# Altium schematic sheet WIRELESS.SchDoc
size A4; SheetNumber: 7; SheetTotal: 7
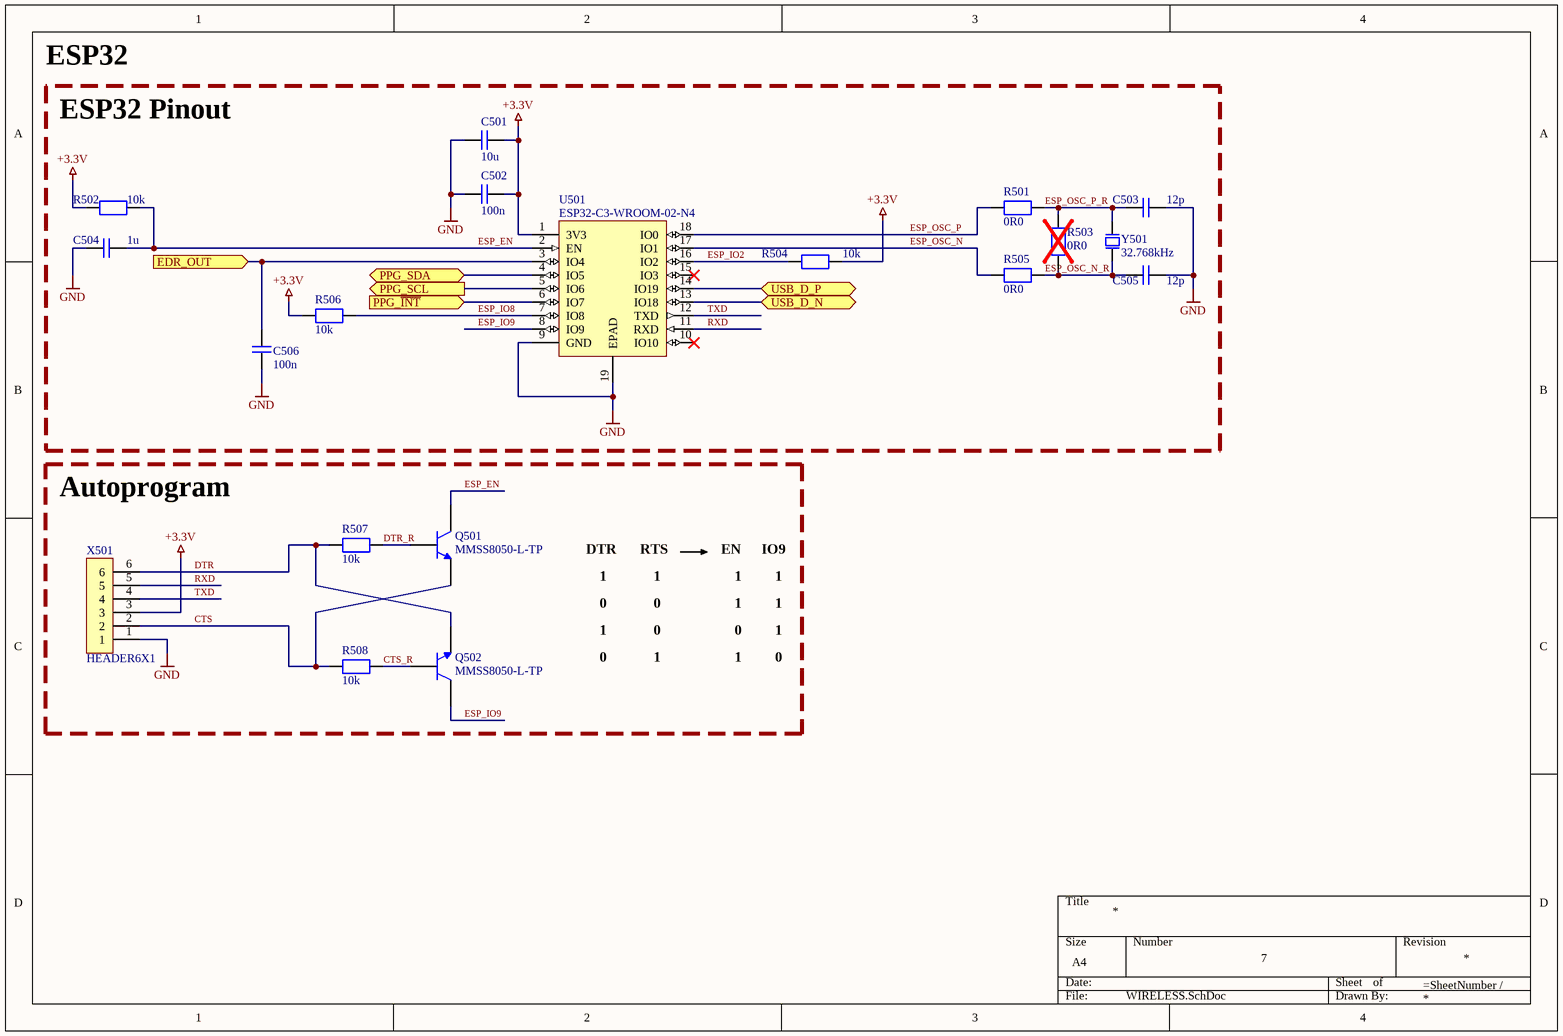
[diagram p0: WIRELESS.SchDoc]

## Parts
C501  10u  [CAPC0603]
C502  100n  [CAPC0603]
C503  12p  [CAPC0603]
C504  1u  [CAPC0603]
C505  12p  [CAPC0603]
C506  100n  [CAPC0603]
Q501  MMSS8050-L-TP  [SOT190P240X290-3]
Q502  MMSS8050-L-TP  [SOT190P240X290-3]
R501  0R0  [RESC0603]
R502  10k  [RESC0603]
R503  0R0  [RESC0603]
R504  10k  [RESC0603]
R505  0R0  [RESC0603]
R506  10k  [RESC0603]
R507  10k  [RESC0603]
R508  10k  [RESC0603]
U501  ESP32-C3-WROOM-02-N4  [ESP32-C3-WROOM-02-N4]
X501  HEADER6X1  [HDR6W64P254_6X1_1524X254X1150]
Y501  32.768kHz  [XTAL320X150X80]

## Blocks framed on the sheet
Autoprogram: Q501 Q502 R507 R508 X501

## Ports
EDR_OUT (in, see SENSORS[3B]), PPG_SCL (out, see SENSORS[2C]), PPG_SDA (bidir, see SENSORS[2C]), PPG_~{INT} (in, see SENSORS[2C]), USB_D_N (bidir, see USB[1C]), USB_D_P (bidir, see USB[1C])

## Nets
+3.3V: C501.2 C502.2 R502.2 R504.1 R506.2 U501.1(3V3) X501.3
GND: C501.1 C502.1 C503.2 C504.2 C505.2 C506.1 U501.9(GND) U501.19(EPAD) X501.1
CTS: Q501.2(E) R508.1 X501.2
CTS_R: Q502.1(B) R508.2
DTR: Q502.2(E) R507.1 X501.6
DTR_R: Q501.1(B) R507.2
EDR_OUT: C506.2 U501.3(IO4) ; port EDR_OUT
ESP_EN: C504.1 Q501.3(C) R502.1 U501.2(EN)
ESP_IO2: R504.2 U501.16(IO2)
ESP_IO8: R506.1 U501.7(IO8)
ESP_IO9: Q502.3(C) U501.8(IO9)
ESP_OSC_N: R505.1 U501.17(IO1)
ESP_OSC_N_R: C505.1 R503.1 R505.2 Y501.1
ESP_OSC_P: R501.1 U501.18(IO0)
ESP_OSC_P_R: C503.1 R501.2 R503.2 Y501.2
PPG_~{INT}: U501.6(IO7) ; port PPG_~{INT}
PPG_SCL: U501.5(IO6) ; port PPG_SCL
PPG_SDA: U501.4(IO5) ; port PPG_SDA
RXD: U501.11(RXD) X501.5
TXD: U501.12(TXD) X501.4
USB_D_N: U501.13(IO18) ; port USB_D_N
USB_D_P: U501.14(IO19) ; port USB_D_P

Not connected (* = marked no-connect by the designer): U501 10(IO10)* 15(IO3)*

## Notes on the sheet
- ESP32
- ESP32 Pinout
- DTR
- 1
- RTS
- EN
- IO9
- 0

## Library data of the parts
C501 = CAPC0603-10u-20: Ceramic capacitor, 10uF,  25V, X5R; MFR: TAIYO YUDEN; MFRN: TMK107BBJ106MA-T; SPN: 963-TMK107BBJ106MA-T; Checked: Yes; Footprint: 0603; Supplier: Mouser; Link: https://hr.mouser.com/ProductDetail/TAIYO-YUDEN/TMK107BBJ106MA-T?qs=lkMpTOwszhf2a50BCYsq8A%3D%3D
C502 C506 = CAPC0603-100n-10: Ceramic capacitor, 100nF,  50V, X7R; MFR: KEMET; MFRN: C0603C104K5RACAUTO; SPN: 80-C0603C104K5RAUTO; Checked: Yes; Footprint: 0603; Supplier: Mouser; Link: https://hr.mouser.com/ProductDetail/KEMET/C0603C104K5RACAUTO?qs=8xX%252BF9%252BWV6EZsgKw9G0PqQ%3D%3D
C503 C505 = CAPC0603-12p-1: Ceramic capacitor, 12pF,  100V, C0G; MFR: Murata Electronics; MFRN: GCM1885C2A120FA16D; SPN: 81-GCM1885C2A120FA6D; Checked: Yes; Footprint: 0603; Supplier: Mouser; Link: https://hr.mouser.com/ProductDetail/Murata-Electronics/GCM1885C2A120FA16D?qs=QzBtWTOodeUaZCEup3XR9g%3D%3D
C504 = CAPC0603-1u-10: Ceramic capacitor, 1uF,  50V, X5R; MFR: Murata Electronics; MFRN: GRT188R61H105KE13D; SPN: 81-GRT188R61H105KE3D; Checked: Yes; Footprint: 0603; Supplier: Mouser; Link: https://hr.mouser.com/ProductDetail/Murata-Electronics/GRT188R61H105KE13D?qs=drgMNd%252BkGPNIxxtJByMGCg%3D%3D
Q501 Q502 = MMSS8050-L-TP: BJT, NPN, 25V, 1.5A; MFR: Micro Commercial Components (MCC); SPN: 833-MMSS8050-L-TP; Checked: No; Footprint: SOT23-3; Supplier: Mouser; MFRN: MMSS8050-L-TP; Link: https://hr.mouser.com/ProductDetail/Micro-Commercial-Components-MCC/MMSS8050-L-TP?qs=FaVZESsvgnebflbaqJWJVQ%3D%3D
R501 R503 R505 = RES0603-0R0-1: Thick film resistor, 0Ohms, 100mW; MFR: YAGEO; MFRN: RC0603FR-070RL; SPN: 603-RC0603FR-070RL; Checked: Yes; Footprint: 0603; Supplier: Mouser; Link: https://hr.mouser.com/ProductDetail/YAGEO/RC0603FR-070RL?qs=0yPvnVz5%2FmpDQv43TwvCfw%3D%3D
R502 R504 R506-R508 = RES0603-10k-1: Thick film resistor, 10kOhm, 100mW; MFR: YAGEO; MFRN: RC0603FR-1010KL; SPN: 603-RC0603FR-1010KL; Checked: Yes; Footprint: 0603; Supplier: Mouser; Link: https://hr.mouser.com/ProductDetail/YAGEO/RC0603FR-1010KL?qs=sGAEpiMZZMtlubZbdhIBIHvQf5egq9lvqRHakiGwa0o%3D
U501 = ESP32-C3-WROOM-02-N4: RF transceiver module, Bluetooth, WiFi; MFR: Espressif Systems; SPN: 356-ESP32C3WROOM02N4; Checked: Yes; Supplier: Mouser; MFRN: ESP32-C3-WROOM-02-N4; Link: https://hr.mouser.com/ProductDetail/Espressif-Systems/ESP32-C3-WROOM-02-N4?qs=sGAEpiMZZMu3sxpa5v1qrhrB%252BBlYHY1O2YkhFjq1w70%3D
X501 = HEADER6X1: Pin header, 6x1, 100mil pitch; MFR: Adam Tech; MFRN: PH1-06-UA; SPN: 737-PH1-06-UA; Checked: Yes; Footprint: HEADER6X1; Supplier: Mouser; Link: https://hr.mouser.com/ProductDetail/Adam-Tech/PH1-06-UA?qs=HoCaDK9Nz5eIYt3TJpOa9Q%3D%3D
Y501 = FC-135R 32.7680KA-AC: Crystal, 32.768Hz, 9pF, 50kOhms; MFR: Seiko Epson; SPN: 732-5R32.7680KA-AC; Checked: Yes; Footprint: SMD3215-2P; Supplier: Mouser; MFRN: FC-135R 32.7680KA-AC; Link: https://hr.mouser.com/ProductDetail/Epson-Timing/FC-135R-32.7680KA-AC?qs=f9yNj16SXrKSyqlBEaNvJg%3D%3D